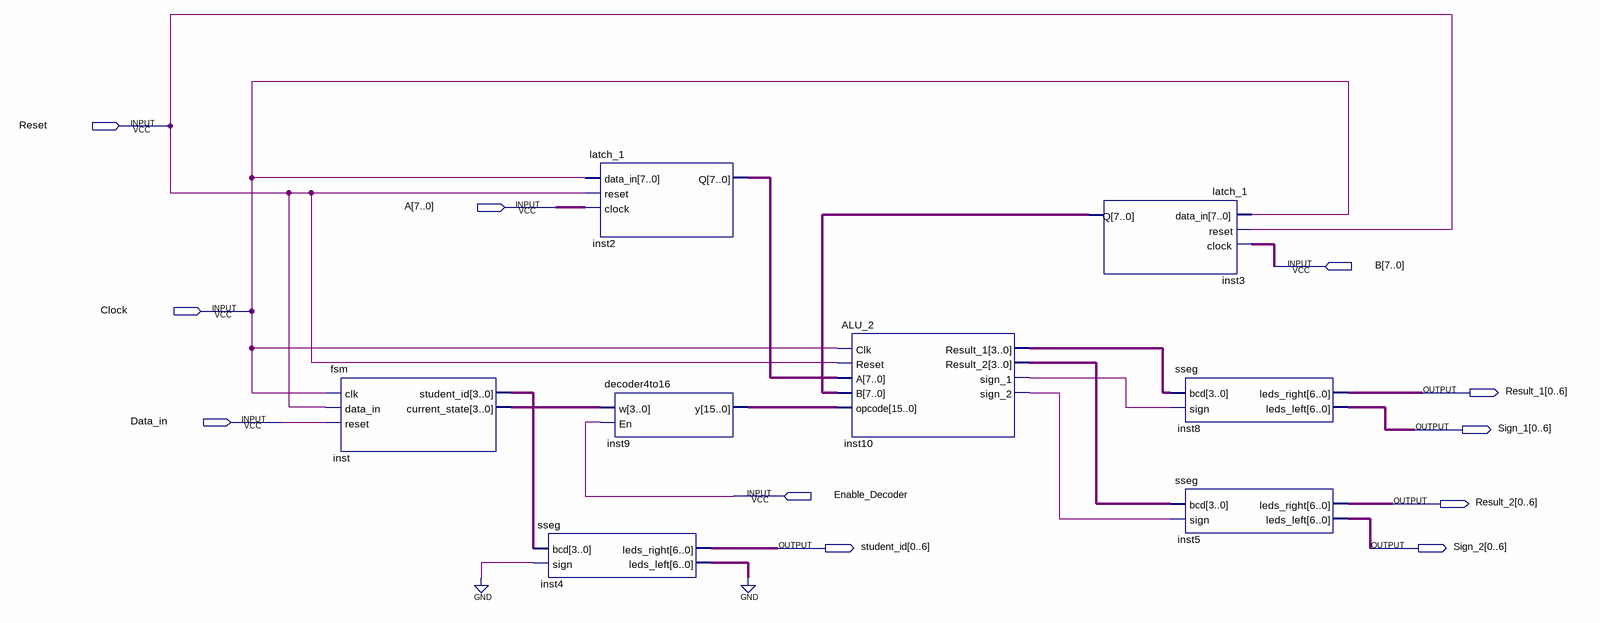
[diagram p0: schematic sheet]
// Quartus schematic ALUProblem2.bdf as structural Verilog: 8 symbols, 11 pins
module ALUProblem2 (
  input  Reset,
  input  [7:0] A,
  input  [7:0] B,
  input  Clock,
  input  Data_in,
  input  Enable_Decoder,
  output [0:6] Result_1,
  output [0:6] Sign_1,
  output [0:6] Result_2,
  output [0:6] student_id,
  output [0:6] Sign_2
);

  wire inst10_sign_1, inst10_sign_2;
  wire [3:0] inst10_result_1, inst10_result_2, inst_current_state, inst_student_id;
  wire [6:0] inst4_leds_left;
  wire [7:0] inst2_q, inst3_q;
  wire [15:0] inst9_y;

  fsm inst (
    .clk(Clock), .data_in(Reset), .reset(Data_in), .student_id(inst_student_id),
    .current_state(inst_current_state));
  sseg inst4 (.bcd(inst_student_id), .sign(1'b0), .leds_right(student_id), .leds_left(inst4_leds_left));
  latch_1 inst2 (.data_in({8{Clock}}), .reset(Reset), .clock(A), .Q(inst2_q));
  decoder4to16 inst9 (.w(inst_current_state), .En(Enable_Decoder), .y(inst9_y));
  ALU_2 inst10 (
    .Clk(Clock), .Reset(Reset), .A(inst2_q), .B(inst3_q), .opcode(inst9_y), .Result_1(inst10_result_1),
    .Result_2(inst10_result_2), .sign_1(inst10_sign_1), .sign_2(inst10_sign_2));
  latch_1 inst3 (.data_in({8{Clock}}), .reset(Reset), .clock(B), .Q(inst3_q));
  sseg inst8 (.bcd(inst10_result_1), .sign(inst10_sign_1), .leds_right(Result_1), .leds_left(Sign_1));
  sseg inst5 (.bcd(inst10_result_2), .sign(inst10_sign_2), .leds_right(Result_2), .leds_left(Sign_2));
  // also tied to GND on the sheet: {inst4_leds_left[0], inst4_leds_left[1], inst4_leds_left[2], inst4_leds_left[3], inst4_leds_left[4], inst4_leds_left[5], inst4_leds_left[6]}
endmodule
